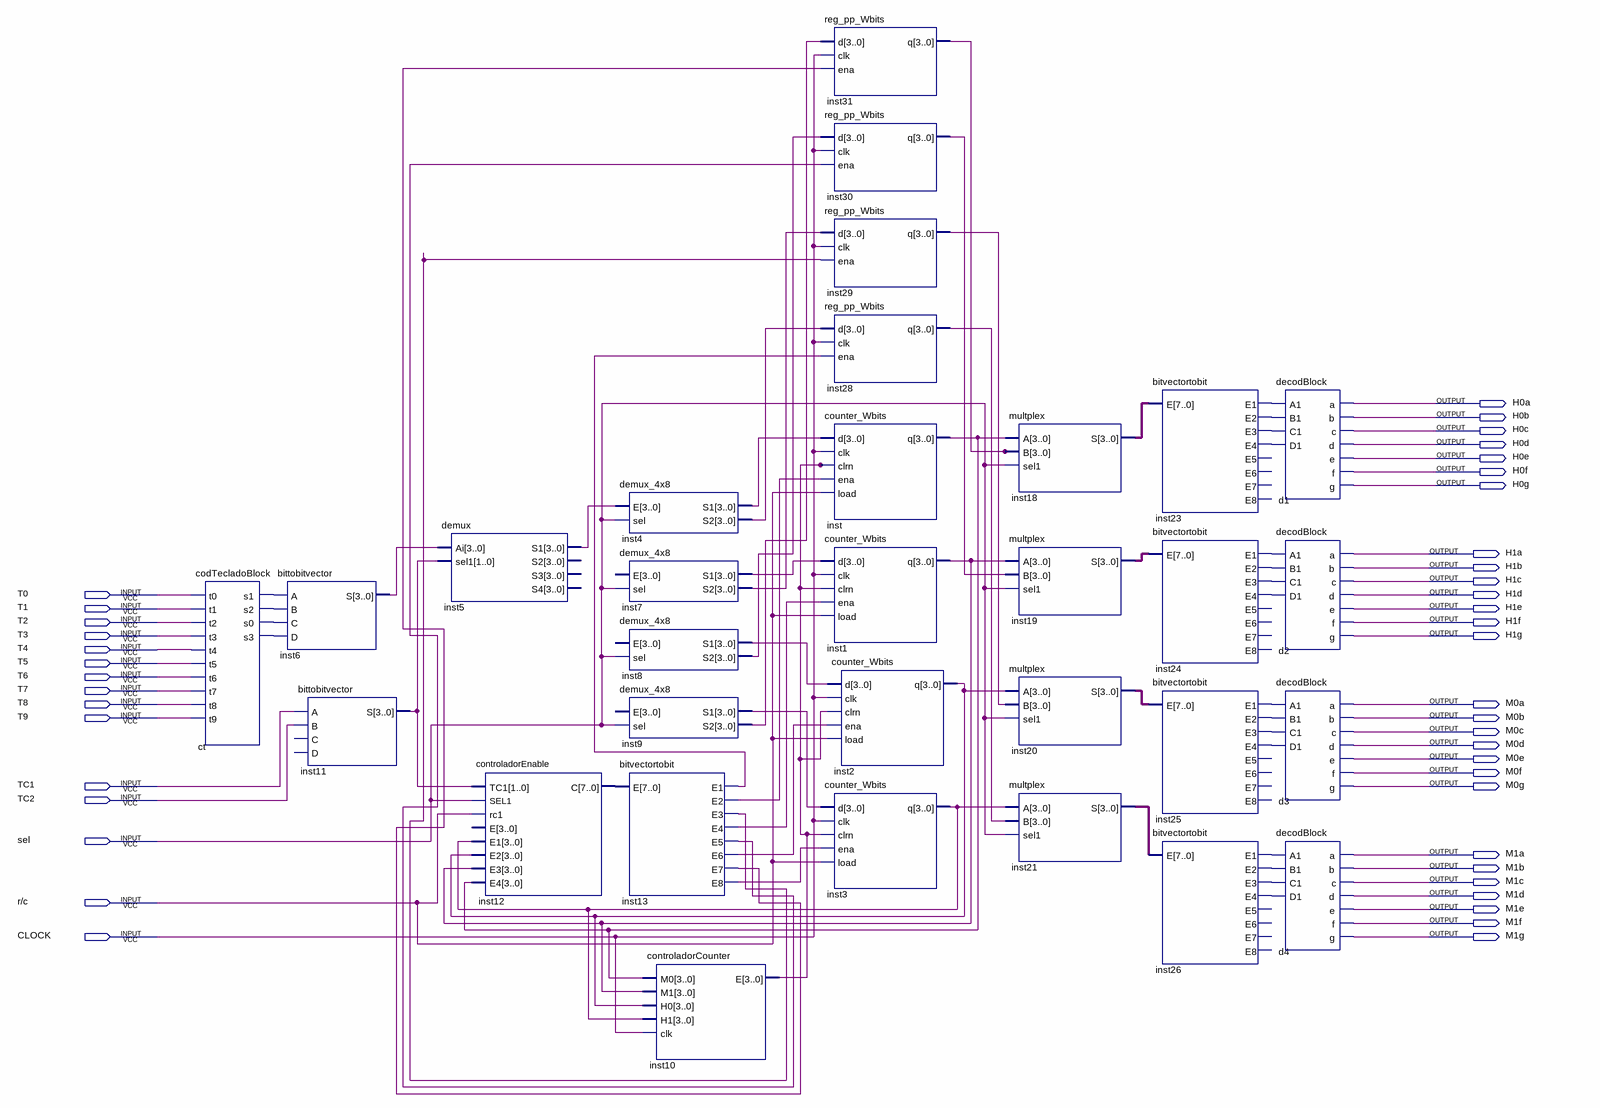
[diagram p0: schematic sheet]
// Quartus schematic relogioBlock.bdf as structural Verilog: 31 symbols, 43 pins
module relogioBlock (
  input  T0,
  input  T1,
  input  T2,
  input  T3,
  input  T4,
  input  T5,
  input  T6,
  input  T7,
  input  T8,
  input  T9,
  input  TC1,
  input  TC2,
  input  sel,
  input  \r/c ,
  input  CLOCK,
  output H0a,
  output H0b,
  output H0c,
  output H0d,
  output H0e,
  output H0f,
  output H0g,
  output H1a,
  output H1b,
  output H1c,
  output H1d,
  output H1e,
  output H1f,
  output H1g,
  output M0a,
  output M0b,
  output M0c,
  output M0d,
  output M0e,
  output M0f,
  output M0g,
  output M1a,
  output M1b,
  output M1c,
  output M1d,
  output M1e,
  output M1f,
  output M1g
);

  wire ct_s0, ct_s1, ct_s2, ct_s3, inst10_e, inst11_s, inst13_e1, inst13_e2, inst13_e3, inst13_e4, inst13_e5,
       inst13_e6, inst13_e7, inst13_e8, inst23_e1, inst23_e2, inst23_e3, inst23_e4, inst24_e1, inst24_e2,
       inst24_e3, inst24_e4, inst25_e1, inst25_e2, inst25_e3, inst25_e4, inst26_e1, inst26_e2, inst26_e3,
       inst26_e4;
  wire [3:0] inst1_q, inst2_q, inst3_q, inst4_s1, inst4_s2, inst5_s1, inst6_s, inst7_s1, inst7_s2, inst8_s1,
       inst8_s2, inst9_s1, inst9_s2, inst28_q, inst29_q, inst30_q, inst31_q, inst_q;
  wire [7:0] inst12_c, inst18_s, inst19_s, inst20_s, inst21_s;

  codTecladoBlock ct (
    .t0(T0), .t1(T1), .t2(T2), .t3(T3), .t4(T4), .t5(T5), .t6(T6), .t7(T7), .t8(T8), .t9(T9), .s1(ct_s1),
    .s2(ct_s2), .s0(ct_s0), .s3(ct_s3));
  bittobitvector inst6 (.A(ct_s1), .B(ct_s2), .C(ct_s0), .D(ct_s3), .S(inst6_s));
  bittobitvector inst11 (.A(TC1), .B(TC2), .S(inst11_s));  // open: C, D
  demux inst5 (.Ai(inst6_s), .sel1({2{inst11_s}}), .S1(inst5_s1));  // open: S2, S3, S4
  controladorEnable inst12 (
    .TC1({2{inst11_s}}), .SEL1(sel), .rc1(\r/c ), .E1(inst3_q), .E2(inst2_q), .E3(inst1_q), .E4(inst_q),
    .C(inst12_c));  // open: E
  demux_4x8 inst4 (.E(inst5_s1), .sel(sel), .S1(inst4_s1), .S2(inst4_s2));
  demux_4x8 inst7 (.sel(sel), .S1(inst7_s1), .S2(inst7_s2));  // open: E
  demux_4x8 inst8 (.sel(sel), .S1(inst8_s1), .S2(inst8_s2));  // open: E
  demux_4x8 inst9 (.sel(sel), .S1(inst9_s1), .S2(inst9_s2));  // open: E
  bitvectortobit inst13 (
    .E(inst12_c), .E1(inst13_e1), .E2(inst13_e2), .E3(inst13_e3), .E4(inst13_e4), .E5(inst13_e5),
    .E6(inst13_e6), .E7(inst13_e7), .E8(inst13_e8));
  controladorCounter inst10 (.M0(inst_q), .M1(inst1_q), .H0(inst2_q), .H1(inst3_q), .clk(CLOCK), .E(inst10_e));
  reg_pp_Wbits inst31 (.d(inst9_s2), .clk(CLOCK), .ena(inst13_e7), .q(inst31_q));
  reg_pp_Wbits inst30 (.d(inst8_s2), .clk(CLOCK), .ena(inst13_e5), .q(inst30_q));
  reg_pp_Wbits inst29 (.d(inst7_s2), .clk(CLOCK), .ena(inst13_e3), .q(inst29_q));
  reg_pp_Wbits inst28 (.d(inst4_s2), .clk(CLOCK), .ena(inst13_e1), .q(inst28_q));
  counter_Wbits inst (.d(inst4_s1), .clk(CLOCK), .clrn(inst10_e), .ena(inst13_e2), .load(\r/c ), .q(inst_q));
  counter_Wbits inst1 (.d(inst7_s1), .clk(CLOCK), .clrn(inst10_e), .ena(inst13_e4), .load(\r/c ), .q(inst1_q));
  counter_Wbits inst2 (.d(inst8_s1), .clk(CLOCK), .clrn(inst10_e), .ena(inst13_e6), .load(\r/c ), .q(inst2_q));
  counter_Wbits inst3 (.d(inst9_s1), .clk(CLOCK), .clrn(inst10_e), .ena(inst13_e8), .load(\r/c ), .q(inst3_q));
  multplex inst18 (.A(inst_q), .B(inst31_q), .sel1(sel), .S(inst18_s));
  multplex inst19 (.A(inst1_q), .B(inst30_q), .sel1(sel), .S(inst19_s));
  multplex inst20 (.A(inst2_q), .B(inst29_q), .sel1(sel), .S(inst20_s));
  multplex inst21 (.A(inst3_q), .B(inst28_q), .sel1(sel), .S(inst21_s));
  bitvectortobit inst23 (
    .E(inst18_s), .E1(inst23_e1), .E2(inst23_e2), .E3(inst23_e3), .E4(inst23_e4));  // open: E5, E6, E7, E8
  bitvectortobit inst24 (
    .E(inst19_s), .E1(inst24_e1), .E2(inst24_e2), .E3(inst24_e3), .E4(inst24_e4));  // open: E5, E6, E7, E8
  bitvectortobit inst25 (
    .E(inst20_s), .E1(inst25_e1), .E2(inst25_e2), .E3(inst25_e3), .E4(inst25_e4));  // open: E5, E6, E7, E8
  bitvectortobit inst26 (
    .E(inst21_s), .E1(inst26_e1), .E2(inst26_e2), .E3(inst26_e3), .E4(inst26_e4));  // open: E5, E6, E7, E8
  decodBlock d1 (
    .A1(inst23_e1), .B1(inst23_e2), .C1(inst23_e3), .D1(inst23_e4), .a(H0a), .b(H0b), .c(H0c), .d(H0d),
    .e(H0e), .f(H0f), .g(H0g));
  decodBlock d2 (
    .A1(inst24_e1), .B1(inst24_e2), .C1(inst24_e3), .D1(inst24_e4), .a(H1a), .b(H1b), .c(H1c), .d(H1d),
    .e(H1e), .f(H1f), .g(H1g));
  decodBlock d3 (
    .A1(inst25_e1), .B1(inst25_e2), .C1(inst25_e3), .D1(inst25_e4), .a(M0a), .b(M0b), .c(M0c), .d(M0d),
    .e(M0e), .f(M0f), .g(M0g));
  decodBlock d4 (
    .A1(inst26_e1), .B1(inst26_e2), .C1(inst26_e3), .D1(inst26_e4), .a(M1a), .b(M1b), .c(M1c), .d(M1d),
    .e(M1e), .f(M1f), .g(M1g));
endmodule
